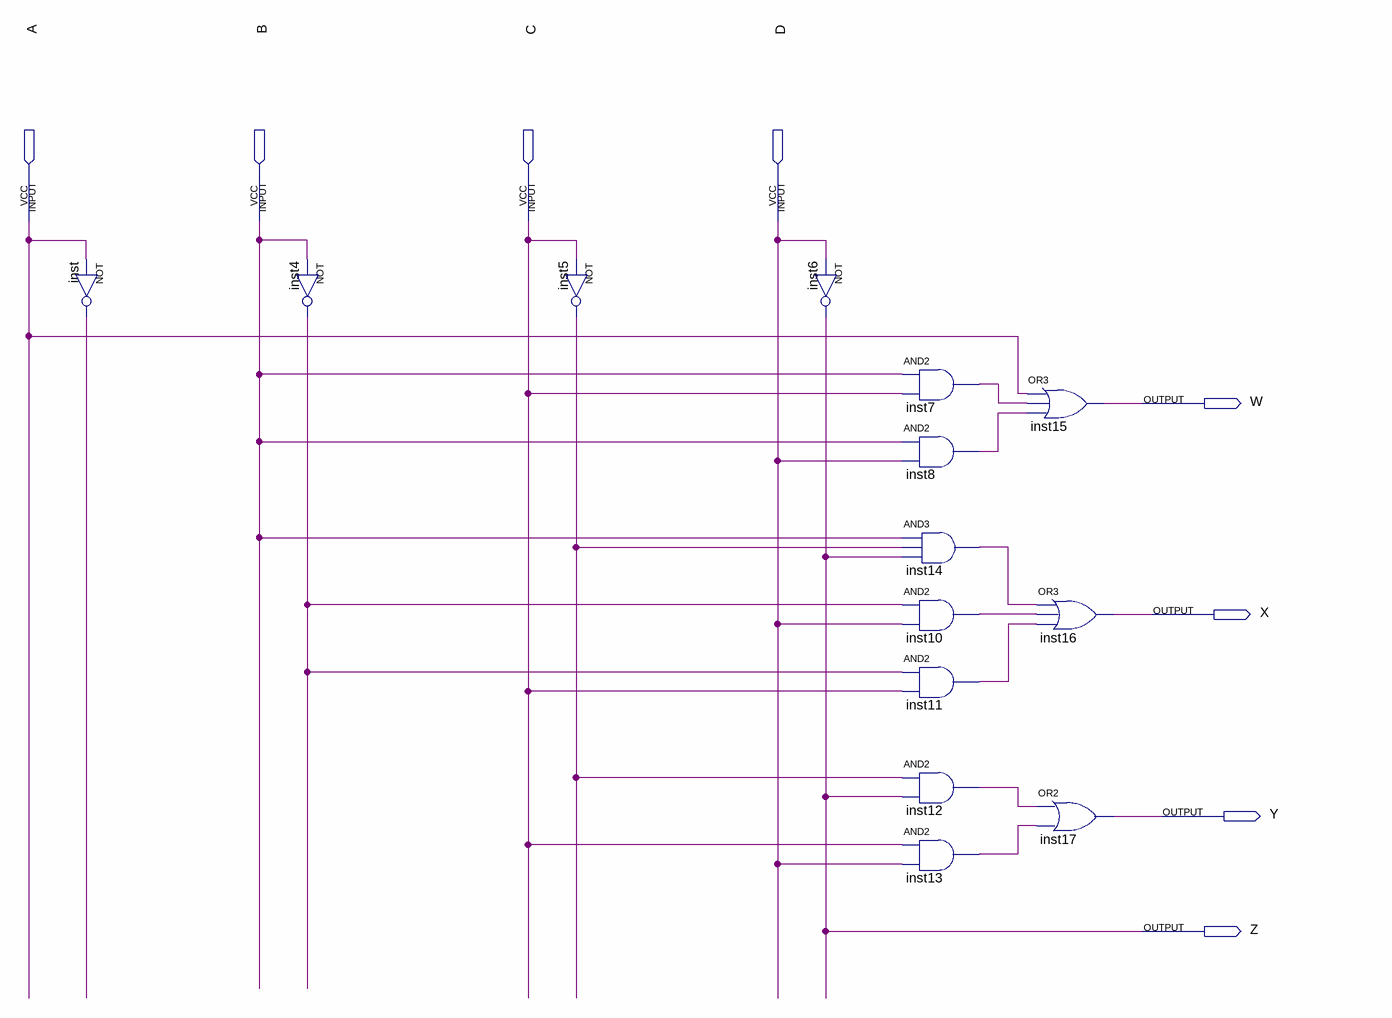
[diagram p0: schematic sheet]
// Quartus schematic lab2_2.bdf as structural Verilog: 14 symbols, 8 pins
module lab2_2 (
  input  A,
  input  B,
  input  C,
  input  D,
  output W,
  output X,
  output Y,
  output Z
);

  wire inst4_out, inst5_out, inst7_out, inst8_out, inst10_out, inst11_out, inst12_out, inst13_out,
       inst14_out, inst_out;

  not inst (inst_out, A);
  not inst4 (inst4_out, B);
  not inst5 (inst5_out, C);
  not inst6 (Z, D);
  and inst7 (inst7_out, B, C);
  and inst8 (inst8_out, B, D);
  and inst14 (inst14_out, B, inst5_out, Z);
  and inst10 (inst10_out, inst4_out, D);
  and inst11 (inst11_out, inst4_out, C);
  and inst12 (inst12_out, inst5_out, Z);
  and inst13 (inst13_out, C, D);
  or inst15 (W, A, inst7_out, inst8_out);
  or inst16 (X, inst14_out, inst10_out, inst11_out);
  or inst17 (Y, inst12_out, inst13_out);
endmodule
